# Altium schematic sheet CM3_USBHub.SchDoc
size A4; DocumentNumber: 4; SheetNumber: 4; SheetTotal: 4; SheetTitle: 4
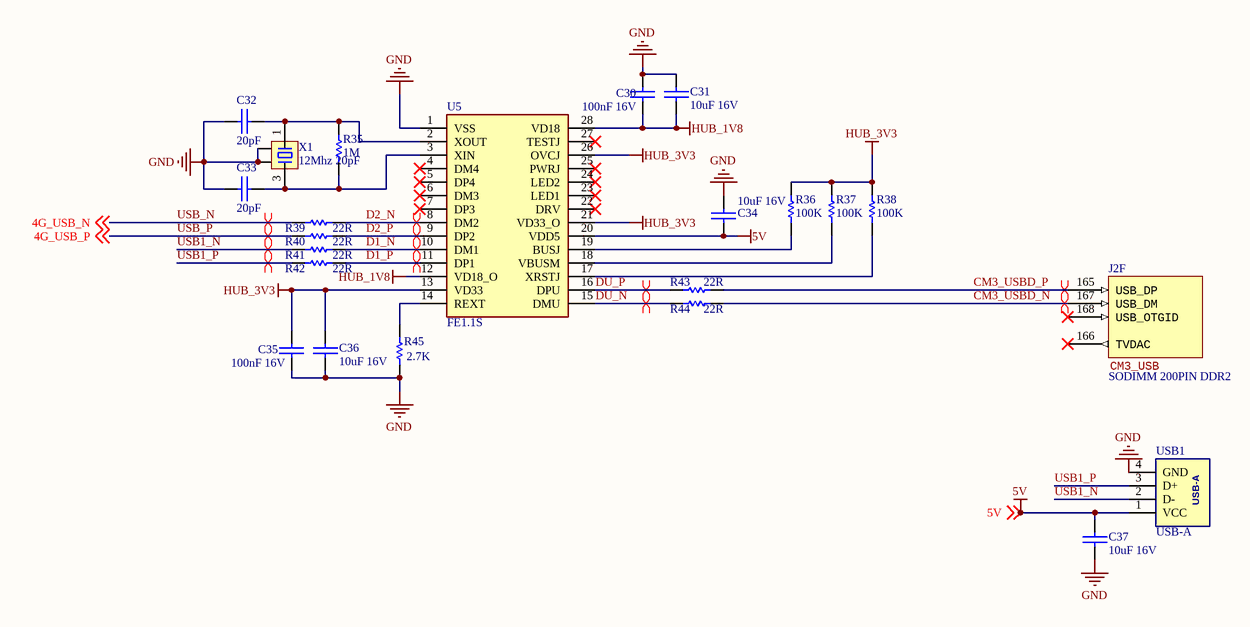
[diagram p0: CM3_USBHub.SchDoc]

## Parts
C30  100nF 16V  [0402C]
C31  10uF 16V  [0603C]
C32  20pF  [0402C]
C33  20pF  [0402C]
C34  10uF 16V  [0603C]
C35  100nF 16V  [0402C]
C36  10uF 16V  [0603C]
C37  10uF 16V  [0603C]
J2  SODIMM 200PIN DDR2  [SODIMM 200PIN - 5.2H]  (part F of 13)
R35  1M  [0402R]
R36  100K  [0402R]
R37  100K  [0402R]
R38  100K  [0402R]
R39  22R  [0402R]
R40  22R  [0402R]
R41  22R  [0402R]
R42  22R  [0402R]
R43  22R  [0402R]
R44  22R  [0402R]
R45  2.7K  [0402R]
U5  FE1.1S  [SOP64P600X175-28N]
USB1  USB-A  [USB_A/F-SMT]
X1  12Mhz 20pF  [OSC 3225-4P]

## Nets
5V: C34.2 C37.2 U5.20(VDD5) USB1.1(VCC) ; off-sheet 5V
GND: C30.2 C31.1 C32.2 C33.1 C34.1 C35.1 C36.2 C37.1 R45.1 U5.1(VSS) USB1.4(GND) X1.2 X1.4
HUB_1V8: C30.1 C31.2 U5.12(VD18_O) U5.28(VD18)
HUB_3V3: C35.2 C36.1 R36.2 R37.2 R38.2 U5.13(VD33) U5.21(VD33_O) U5.26(OVCJ)
CM3_USBD_N: J2.167(USB_DM) R44.1
CM3_USBD_P: J2.165(USB_DP) R43.1
D1_N: R41.1 U5.10(DM1)
D1_P: R42.1 U5.11(DP1)
D2_N: R39.1 U5.8(DM2)
D2_P: R40.1 U5.9(DP2)
DU_N: R44.2 U5.15(DMU)
DU_P: R43.2 U5.16(DPU)
USB1_N: R41.2 USB1.2(D-)
USB1_P: R42.2 USB1.3(D+)
USB_N: R39.2 ; off-sheet 4G_USB_N  [also labelled 4G_USB_N]
USB_P: R40.2 ; off-sheet 4G_USB_P  [also labelled 4G_USB_P]
NetC32_1: C32.1 R35.2 U5.2(XOUT) X1.1
NetC33_2: C33.2 R35.1 U5.3(XIN) X1.3
NetR36_1: R36.1 U5.19(BUSJ)
NetR37_1: R37.1 U5.18(VBUSM)
NetR38_1: R38.1 U5.17(XRSTJ)
NetR45_2: R45.2 U5.14(REXT)

Not connected (* = marked no-connect by the designer): J2 166(TVDAC)* 168(USB_OTGID)*; U5 4(DM4)* 5(DP4)* 6(DM3)* 7(DP3)* 22(DRV)* 23(LED1)* 24(LED2)* 25(PWRJ)* 27(TESTJ)*

## Layout directives
differential pair: CM3_USBD_N, CM3_USBD_P, D1_N, D1_P, D2_N, D2_P, DU_N, DU_P, USB1_N, USB1_P, USB_N, USB_P

## Notes on the sheet
- Sheet Title
- Project Title
- Size:
- Date:
- A4
- Number:
- Time:
- Revision:
- Sheet
- of
- File:
- Author:
- (in symbol RPi-CM3, part F) CM3_USB

## Library data of the parts
C30-C37 = CAP-NP
J2 = RPi-CM3
R35-R45 = RES
U5 = FE1.1S: Integrated Circuit; Manufacturer_Name: JFD IC; Datasheet Link: https://cdn-shop.adafruit.com/product-files/2991/FE1.1s+Data+Sheet+(Rev.+1.0).pdf; Height: 1.75mm; Manufacturer_Part_Number: FE1.1S
X1 = XTAL-4P